# Altium schematic sheet Top.SchDoc
size A4; Organization: Altium Limited; Address1: 3 Minna Close; Address2: Belrose; Address3: NSW 2086; Address4: Australia
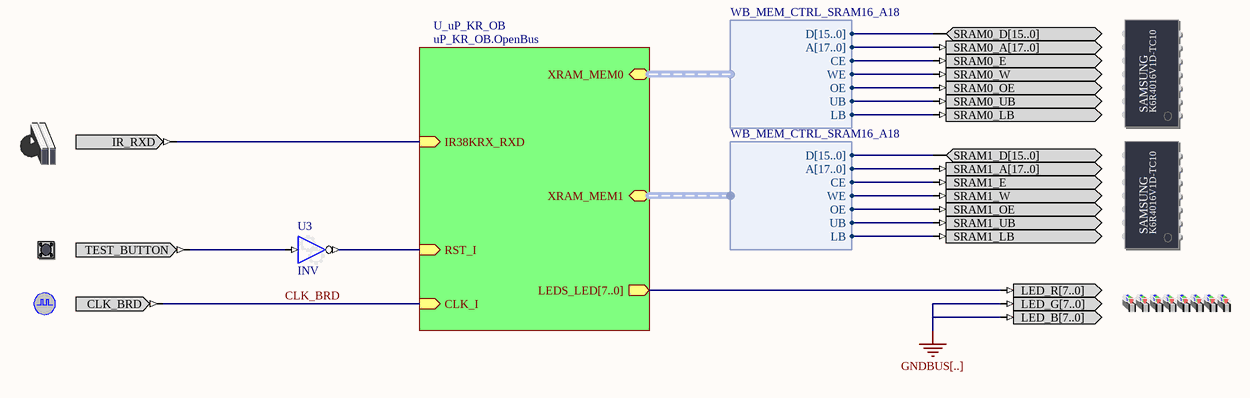
[diagram p0: Top.SchDoc]

## Parts
(Parts that share a designator on the sheet are numbered #1, #2 ... from top to bottom, then left to right.)
?#1  SRAM_DAUGHTER0  (value not drawn)
?#2  IR  (value not drawn)
?#3  SRAM_DAUGHTER1  (value not drawn)
?#4  TEST_BUTTON  (value not drawn)
?#5  CLOCK_BOARD  (value not drawn)
?#6  LEDS_RGB  (value not drawn)
U3  INV

## Sub-sheets
U_uP_KR_OB = uP_KR_OB.OpenBus: RST_I (in), CLK_I (in), XRAM_MEM0 (harness WB_MEM_CTRL_SRAM16_A18), XRAM_MEM1 (harness WB_MEM_CTRL_SRAM16_A18), LEDS_LED[7..0] (out), IR38KRX_RXD (in)

## Harnesses
WB_MEM_CTRL_SRAM16_A18: A[17..0], CE, D[15..0], LB, OE, UB, WE

## Nets
GNDBUS[..]: ?#6.LED_B[7..0] ?#6.LED_G[7..0]
CLK_BRD: ?#5.CLK_BRD ; sheet U_uP_KR_OB/CLK_I
Net?#1_SRAM0_A[17..0]: ?#1.SRAM0_A[17..0] ; sheet U_uP_KR_OB/XRAM_MEM0.A[17..0]
Net?#1_SRAM0_D[15..0]: ?#1.SRAM0_D[15..0] ; sheet U_uP_KR_OB/XRAM_MEM0.D[15..0]
Net?#1_SRAM0_E: ?#1.SRAM0_E ; sheet U_uP_KR_OB/XRAM_MEM0.CE
Net?#1_SRAM0_LB: ?#1.SRAM0_LB ; sheet U_uP_KR_OB/XRAM_MEM0.LB
Net?#1_SRAM0_OE: ?#1.SRAM0_OE ; sheet U_uP_KR_OB/XRAM_MEM0.OE
Net?#1_SRAM0_UB: ?#1.SRAM0_UB ; sheet U_uP_KR_OB/XRAM_MEM0.UB
Net?#1_SRAM0_W: ?#1.SRAM0_W ; sheet U_uP_KR_OB/XRAM_MEM0.WE
Net?#2_IR_RXD: ?#2.IR_RXD ; sheet U_uP_KR_OB/IR38KRX_RXD
Net?#3_SRAM1_A[17..0]: ?#3.SRAM1_A[17..0] ; sheet U_uP_KR_OB/XRAM_MEM1.A[17..0]
Net?#3_SRAM1_D[15..0]: ?#3.SRAM1_D[15..0] ; sheet U_uP_KR_OB/XRAM_MEM1.D[15..0]
Net?#3_SRAM1_E: ?#3.SRAM1_E ; sheet U_uP_KR_OB/XRAM_MEM1.CE
Net?#3_SRAM1_LB: ?#3.SRAM1_LB ; sheet U_uP_KR_OB/XRAM_MEM1.LB
Net?#3_SRAM1_OE: ?#3.SRAM1_OE ; sheet U_uP_KR_OB/XRAM_MEM1.OE
Net?#3_SRAM1_UB: ?#3.SRAM1_UB ; sheet U_uP_KR_OB/XRAM_MEM1.UB
Net?#3_SRAM1_W: ?#3.SRAM1_W ; sheet U_uP_KR_OB/XRAM_MEM1.WE
Net?#4_TEST_BUTTON: ?#4.TEST_BUTTON U3.I
Net?#6_LED_R[7..0]: ?#6.LED_R[7..0] ; sheet U_uP_KR_OB/LEDS_LED[7..0]
NetU3_O: U3.O ; sheet U_uP_KR_OB/RST_I

## Notes on the sheet
- Title
- Size:
- Date:
- A4
- Number:
- Time:
- Revision:
- Sheet
- of
- File:
- (in symbol SRAM_DAUGHTER0) SAMSUNG; K6R4016V1D-TC10
- (in symbol SRAM_DAUGHTER1) SAMSUNG; K6R4016V1D-TC10

## Library data of the parts
?#1 = SRAM_DAUGHTER0: Free Static RAM - Daughterboard; PortComponent: True; Published: 14-May-2007; Publisher: Altium Limited; HelpURL: TR0149 Technical Reference for Altium's Xilinx Spartan-3 Daughter Board DB30.pdf#page=16
?#2 = IR: 4 Mbits/s IRDA; PortComponent: True; Published: 22-Jan-2007; Publisher: Altium Limited; HelpURL: https://wiki.altium.com/display/ADOH/NanoBoard+3000+-+IR+Receiver
?#3 = SRAM_DAUGHTER1: Free Static RAM - Daughterboard; PortComponent: True; Published: 14-May-2007; Publisher: Altium Limited; HelpURL: TR0149 Technical Reference for Altium's Xilinx Spartan-3 Daughter Board DB30.pdf#page=16
?#4 = TEST_BUTTON: Test / Reset Button; PortComponent: True; Published: 19-Nov-2003; Publisher: Altium Limited; HelpURL: TR0143 Technical Reference Manual for Altium's Desktop NanoBoard NB2DSK01.pdf#page=53
?#5 = CLOCK_BOARD: Global System Clock Supply; PortComponent: True; Published: 19-Nov-2003; Publisher: Altium Limited; HelpURL: TR0143 Technical Reference Manual for Altium's Desktop NanoBoard NB2DSK01.pdf#page=41; UseInDSF: True
?#6 = LEDS_RGB: LEDS RGB; PortComponent: True; Published: 11-Mar-2009; Publisher: Altium Limited
U3 = INV: Configurable Inverter; ConfigurationParameters: {}Version[1.1]{}SignalCount[1]{}SignalWidth0[1]{}OutputOption0[Inverted]{}EnableMode[None]{}ShowPinNames[False]{}; ConfiguratorName: GENERIC_BUFFER; LastRevisionNo: 1.00.00; Published: 10-Oct-2008; Publisher: Altium Limited